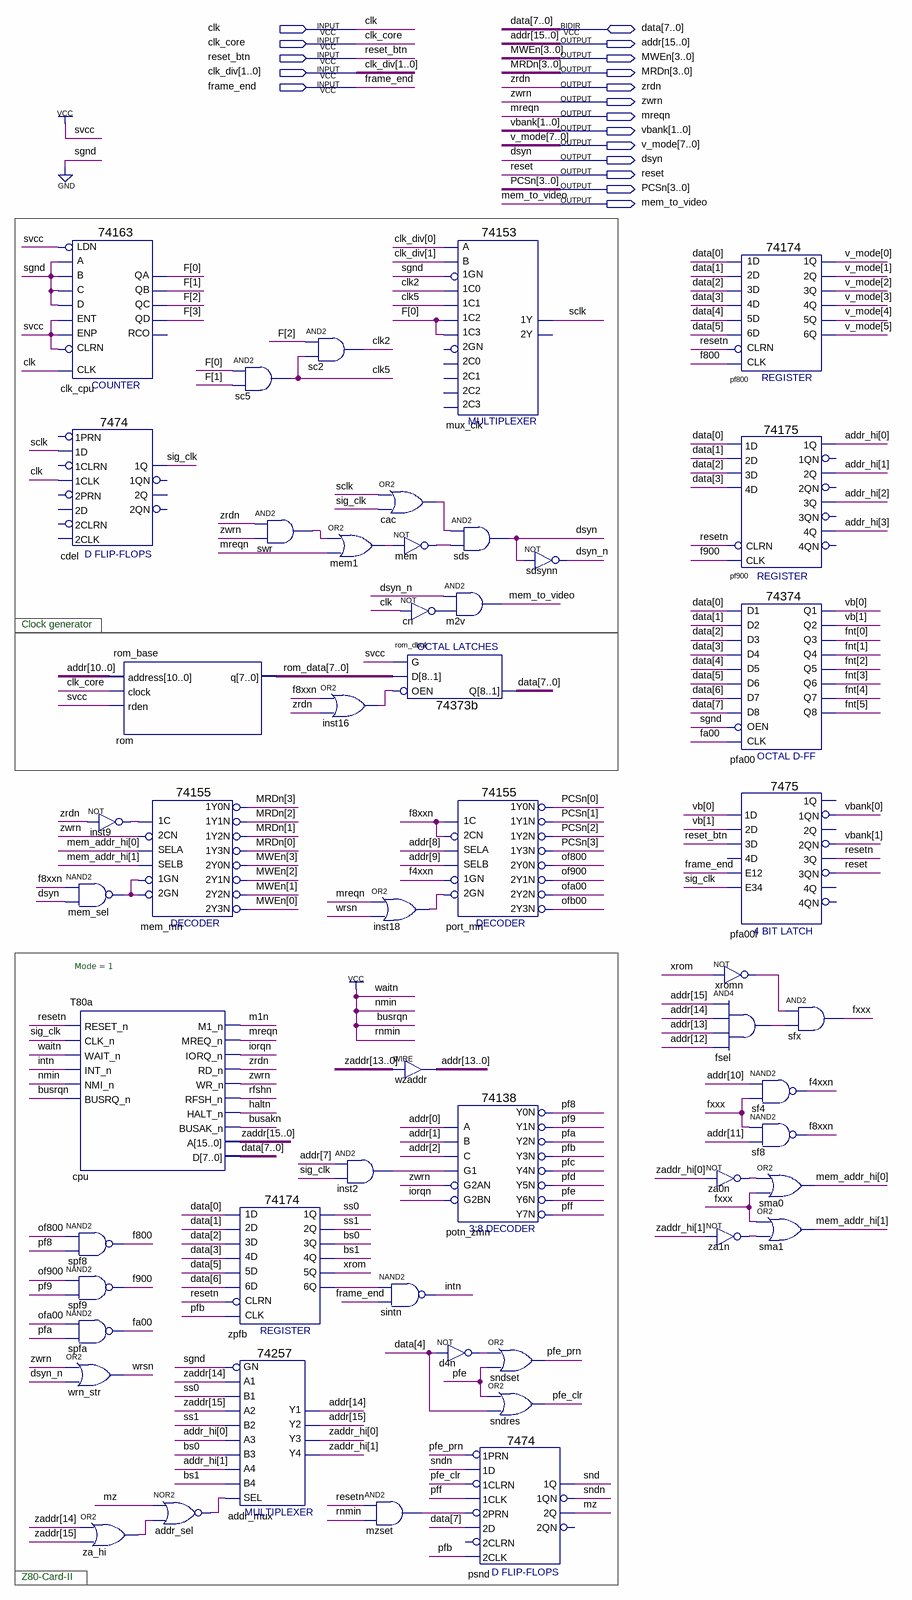
[diagram p0: schematic sheet]
// Quartus schematic orion_cpu_sch.bdf as structural Verilog: 52 symbols, 18 pins
module orion_cpu_sch (
  input  clk,
  input  clk_core,
  input  reset_btn,
  input  [1:0] clk_div,
  input  frame_end,
  inout  [7:0] data,
  output [15:0] addr,
  output [3:0] MWEn,
  output [3:0] MRDn,
  output zrdn,
  output zwrn,
  output mreqn,
  output [1:0] vbank,
  output [7:0] v_mode,
  output dsyn,
  output reset,
  output [3:0] PCSn,
  output mem_to_video
);

  wire addr_sel_out, bs0, bs1, busakn, cac_out, clk2, clk5, cn_out, d4n_out, dsyn_n, f4xxn, f8xxn, f800,
       f900, fa00, fsel_out, fxxx, haltn, inst2_out, inst9_out, inst16_out, inst18_out, intn, iorqn, m1n,
       mem1_out, mem_out, mem_sel_out, mz, mzset_out, of800, of900, ofa00, ofb00, pf8, pf9, pfa, pfb, pfc,
       pfd, pfe, pfe_clr, pfe_prn, pff, resetn, rfshn, sclk, sig_clk, snd, sndn, ss0, ss1, swr_out, wrsn,
       xrom, xromn_out, za0n_out, za1n_out, za_hi_out, zpfb_6q;
  wire [1:0] mem_addr_hi, vb, zaddr_hi;
  wire [3:0] addr_hi, F;
  wire [5:0] fnt;
  wire [7:0] rom_data;
  wire [15:0] zaddr;

  \74163  clk_cpu (
    .C(1'b0), .B(1'b0), .A(1'b0), .ENT(1'b1), .D(1'b0), .CLRN(1'b1), .CLK(clk), .ENP(1'b1), .LDN(1'b1),
    .QA(F[0]), .QB(F[1]), .QC(F[2]), .QD(F[3]));  // open: RCO
  \7474  cdel (.\1CLK (clk), .\1D (sclk), .\1Q (sig_clk));  // open: 2D, 2PRN, 1PRN, 2CLK, 2CLRN, 1CLRN, 1QN, 2Q, 2QN
  nand mem_sel (mem_sel_out, f8xxn, dsyn);
  T80a #(.Mode(1)) cpu (
    .RESET_n(resetn), .CLK_n(sig_clk), .WAIT_n(1'b1), .INT_n(intn), .NMI_n(1'b1), .BUSRQ_n(1'b1), .M1_n(m1n),
    .MREQ_n(mreqn), .IORQ_n(iorqn), .RD_n(zrdn), .WR_n(zwrn), .RFSH_n(rfshn), .HALT_n(haltn),
    .BUSAK_n(busakn), .A(zaddr), .D(data));
  nand spf8 (f800, of800, pf8);
  nand spf9 (f900, of900, pf9);
  nand spfa (fa00, ofa00, pfa);
  or wrn_str (wrsn, zwrn, dsyn_n);
  rom_base rom (.address(addr[10:0]), .clock(clk_core), .rden(1'b1), .q(rom_data));
  not inst9 (inst9_out, zrdn);
  or za_hi (za_hi_out, zaddr[14], zaddr[15]);
  \74155  mem_mn (
    .\1C (inst9_out), .\2CN (zwrn), .SELB(mem_addr_hi[1]), .SELA(mem_addr_hi[0]), .\1GN (mem_sel_out),
    .\2GN (mem_sel_out), .\1Y2N (MRDn[1]), .\1Y1N (MRDn[2]), .\1Y0N (MRDn[3]), .\2Y1N (MWEn[2]),
    .\2Y0N (MWEn[3]), .\1Y3N (MRDn[0]), .\2Y3N (MWEn[0]), .\2Y2N (MWEn[1]));
  nor addr_sel (addr_sel_out, mz, za_hi_out);
  and sc5 (clk5, F[0], F[1]);
  \74174  zpfb (
    .\4D (data[3]), .\3D (data[2]), .\5D (data[5]), .\6D (data[6]), .CLK(pfb), .CLRN(resetn), .\1D (data[0]),
    .\2D (data[1]), .\1Q (ss0), .\4Q (bs1), .\3Q (bs0), .\2Q (ss1), .\6Q (zpfb_6q), .\5Q (xrom));
  \74257  addr_mux (
    .B1(ss0), .A1(zaddr[14]), .B3(bs0), .A2(zaddr[15]), .B2(ss1), .A3(addr_hi[0]), .A4(addr_hi[1]), .B4(bs1),
    .SEL(addr_sel_out), .GN(1'b0), .Y2(addr[15]), .Y3(zaddr_hi[0]), .Y4(zaddr_hi[1]), .Y1(addr[14]));
  and swr (swr_out, zrdn, zwrn);
  and sc2 (clk2, F[2], clk5);
  or mem1 (mem1_out, swr_out, mreqn);
  or inst16 (inst16_out, f8xxn, zrdn);
  and inst2 (inst2_out, addr[7], sig_clk);
  or cac (cac_out, sclk, sig_clk);
  not mem (mem_out, mem1_out);
  not cn (cn_out, clk);
  \74373b  rom_dbuf (.D(rom_data), .G(1'b1), .OEN(inst16_out), .Q(data));
  or inst18 (inst18_out, mreqn, wrsn);
  assign addr[13:0] = zaddr[13:0];  // WIRE wzaddr
  nand sintn (intn, zpfb_6q, frame_end);
  and mzset (mzset_out, resetn, 1'b1);
  \74153  mux_clk (
    .\1C1 (clk5), .\1GN (1'b0), .\1C0 (clk2), .\1C2 (F[0]), .\1C3 (F[0]), .B(clk_div[1]), .A(clk_div[0]),
    .\1Y (sclk));  // open: 2C0, 2GN, 2C2, 2C1, 2C3, 2Y
  and sds (dsyn, cac_out, mem_out);
  and m2v (mem_to_video, dsyn_n, cn_out);
  \74155  port_mn (
    .\1C (f8xxn), .\2CN (f8xxn), .SELB(addr[9]), .SELA(addr[8]), .\1GN (f4xxn), .\2GN (inst18_out),
    .\1Y2N (PCSn[2]), .\1Y1N (PCSn[1]), .\1Y0N (PCSn[0]), .\2Y1N (of900), .\2Y0N (of800), .\1Y3N (PCSn[3]),
    .\2Y3N (ofb00), .\2Y2N (ofa00));
  \74138  potn_zmn (
    .A(addr[0]), .B(addr[1]), .G1(inst2_out), .C(addr[2]), .G2AN(zwrn), .G2BN(iorqn), .Y0N(pf8), .Y1N(pf9),
    .Y2N(pfa), .Y3N(pfb), .Y4N(pfc), .Y5N(pfd), .Y6N(pfe), .Y7N(pff));
  not d4n (d4n_out, data[4]);
  \7474  psnd (
    .\2D (data[7]), .\2PRN (mzset_out), .\1CLK (pff), .\1D (sndn), .\1PRN (pfe_prn), .\2CLK (pfb),
    .\1CLRN (pfe_clr), .\1QN (sndn), .\2Q (mz), .\1Q (snd));  // open: 2CLRN, 2QN
  not sdsynn (dsyn_n, dsyn);
  or sndset (pfe_prn, d4n_out, pfe);
  or sndres (pfe_clr, pfe, data[4]);
  not za0n (za0n_out, zaddr_hi[0]);
  not za1n (za1n_out, zaddr_hi[1]);
  \74174  pf800 (
    .\4D (data[3]), .\3D (data[2]), .\5D (data[4]), .\6D (data[5]), .CLK(f800), .CLRN(resetn),
    .\1D (data[0]), .\2D (data[1]), .\1Q (v_mode[0]), .\4Q (v_mode[3]), .\3Q (v_mode[2]), .\2Q (v_mode[1]),
    .\6Q (v_mode[5]), .\5Q (v_mode[4]));
  \74175  pf900 (
    .CLRN(resetn), .CLK(f900), .\3D (data[2]), .\2D (data[1]), .\1D (data[0]), .\4D (data[3]),
    .\1Q (addr_hi[0]), .\3Q (addr_hi[2]), .\2Q (addr_hi[1]), .\4Q (addr_hi[3]));  // open: 1QN, 2QN, 4QN, 3QN
  \74374  pfa00 (
    .D1(data[0]), .D2(data[1]), .D3(data[2]), .D4(data[3]), .D6(data[5]), .D5(data[4]), .OEN(1'b0),
    .D8(data[7]), .D7(data[6]), .CLK(fa00), .Q2(vb[1]), .Q3(fnt[0]), .Q5(fnt[2]), .Q4(fnt[1]), .Q6(fnt[3]),
    .Q7(fnt[4]), .Q8(fnt[5]), .Q1(vb[0]));
  \7475  pfa00l (
    .E12(frame_end), .\3D (reset_btn), .\2D (vb[1]), .E34(sig_clk), .\1D (vb[0]), .\1QN (vbank[0]),
    .\3QN (reset), .\3Q (resetn), .\2QN (vbank[1]));  // open: 4D, 1Q, 2Q, 4QN, 4Q
  not xromn (xromn_out, xrom);
  and fsel (fsel_out, addr[15], addr[14], addr[13], addr[12]);
  nand sf4 (f4xxn, addr[10], fxxx);
  nand sf8 (f8xxn, fxxx, addr[11]);
  or sma0 (mem_addr_hi[0], za0n_out, fxxx);
  or sma1 (mem_addr_hi[1], fxxx, za1n_out);
  and sfx (fxxx, xromn_out, fsel_out);

  // Notes on the sheet:
  //   Clock generator
  //   Z80-Card-II
endmodule
